# Altium schematic sheet Connectors.SchDoc
size A4; SheetNumber: 2; SheetTotal: 6
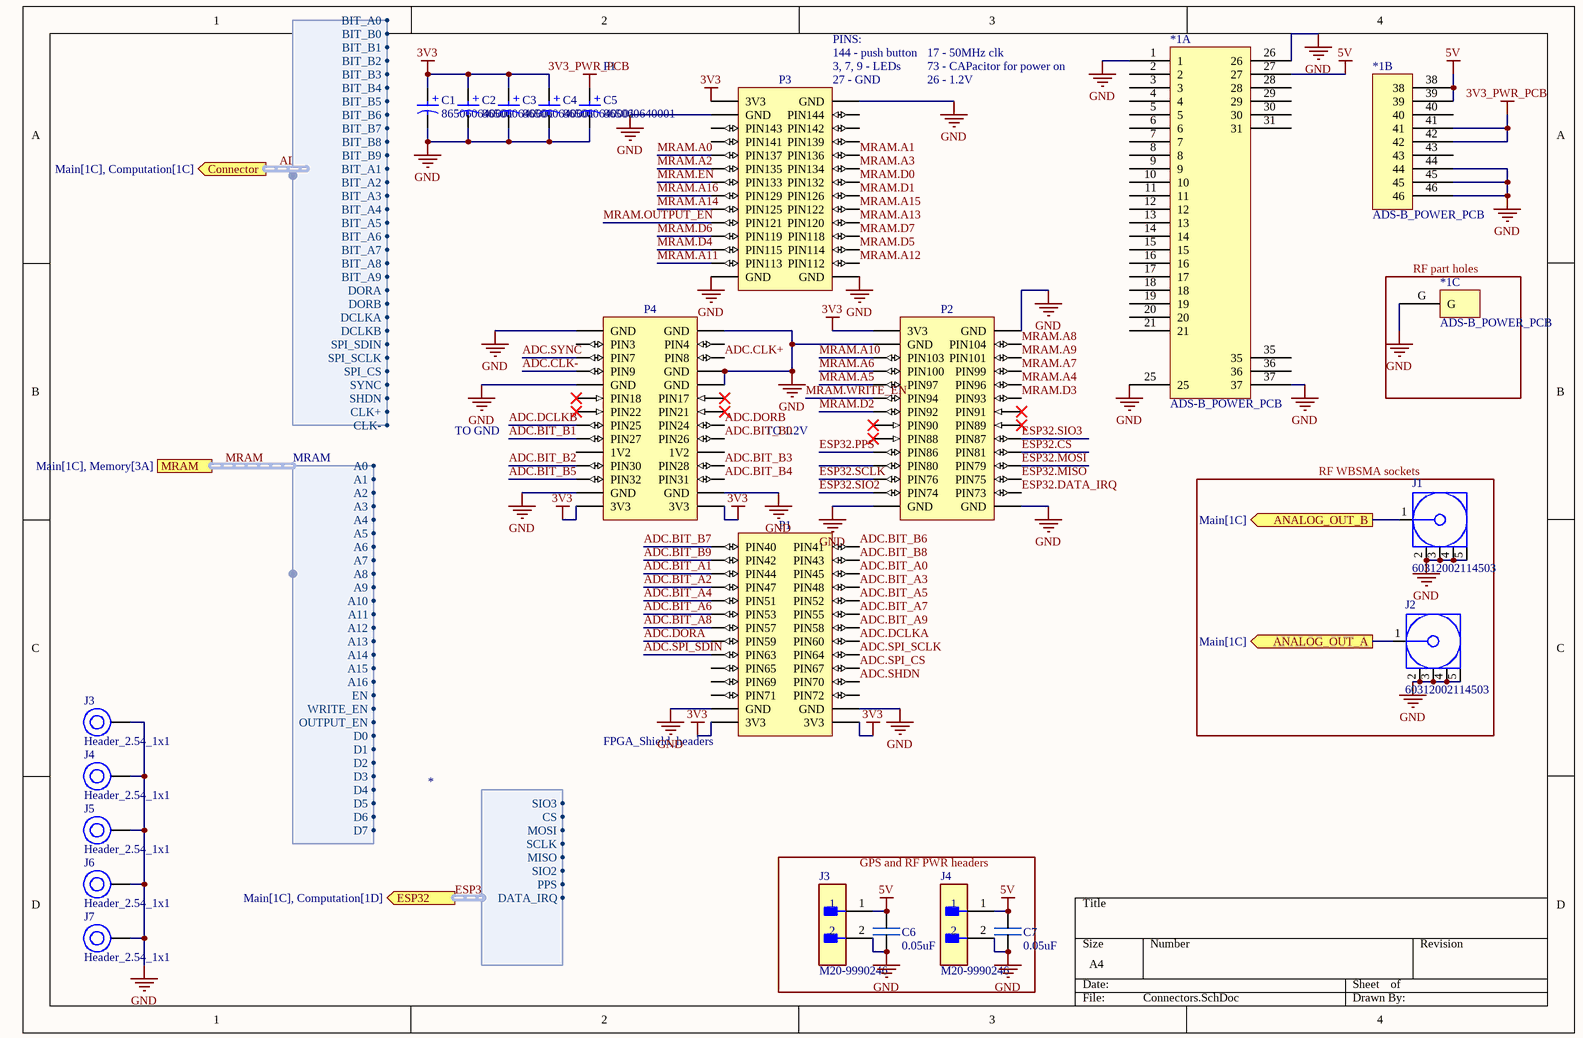
[diagram p0: Connectors.SchDoc]

## Parts
(Parts that share a designator on the sheet are numbered #1, #2 ... from top to bottom, then left to right.)
*1  ADS-B_POWER_PCB  [ADS-B_POWER_PCB]  (parts A,B,C of 3)
C1  865060640001  [WCAP-ASLL_D4H5.5]
C2  865060640001  [WCAP-ASLL_D4H5.5]
C3  865060640001  [WCAP-ASLL_D4H5.5]
C4  865060640001  [WCAP-ASLL_D4H5.5]
C5  865060640001  [WCAP-ASLL_D4H5.5]
C6  0.05uF  [0402_footprint]
C7  0.05uF  [0402_footprint]
J1  60312002114503  [60312002114503]
J2  60312002114503  [60312002114503]
J3#1  Header_2.54_1x1  [HEADER_2.54_1x1]
J3#2  M20-9990246  [FP-M20-9990246-MFG]
J4#1  Header_2.54_1x1  [HEADER_2.54_1x1]
J4#2  M20-9990246  [FP-M20-9990246-MFG]
J5  Header_2.54_1x1  [HEADER_2.54_1x1]
J6  Header_2.54_1x1  [HEADER_2.54_1x1]
J7  Header_2.54_1x1  [HEADER_2.54_1x1]
P1  FPGA_Shield_headers  [FPGA_SHIELD_HEADER_FOOTPRINT]

## Blocks framed on the sheet
RF part holes: *1
RF WBSMA sockets: J1 J2
GPS and RF PWR headers: C6 C7 J3#2 J4#2

## Ports
ANALOG_OUT_A (out, see Main[1C]), ANALOG_OUT_B (out, see Main[1C]), Connector (out, harness Connector, see Main[1C], Computation[1C]), ESP32 (out, harness *, see Main[1C], Computation[1D]), MRAM (harness MRAM, see Main[1C], Memory[3A])

## Harnesses
Connector: BIT_B1, BIT_B2, BIT_B3, BIT_B4, BIT_B5, BIT_B6, BIT_B7, BIT_B8, BIT_B9, BIT_A1, BIT_A2, BIT_A3, BIT_A4, BIT_A5, BIT_A6, BIT_A7, BIT_A8, BIT_A9, DORA, DORB, DCLKA, DCLKB, SPI_SDIN, SPI_SCLK, SPI_CS, SYNC, SHDN, BIT_B0, BIT_A0, CLK+, CLK-
MRAM: A0, A1, A2, A3, A4, A5, A6, A7, A8, A9, A10, A11, A12, A13, A14, A15, A16, EN, WRITE_EN, OUTPUT_EN, D0, D1, D2, D3, D4, D5, D6, D7
*: SIO3, CS, MOSI, SCLK, MISO, SIO2, PPS, DATA_IRQ

## Nets
3V3: C1.1(P) C2.1(P) C3.1(P) C4.1(P) P1.27(3V3) P1.28(3V3) P1.29(3V3) P1.57(3V3) P1.111(3V3) P1.112(3V3)
3V3_PWR_PCB: *1.41 *1.42 C5.1(P)
5V: *1.27 *1.38 *1.39 C6.2 C7.2 J3#2.1 J4#2.1
GND: *1.1 *1.25 *1.26 *1.37 *1.44 *1.45 *1.46 *1.G C1.2(N) C2.2(N) C3.2(N) C4.2(N) C5.2(N) C6.1 C7.1 J1.2(GND) J1.3(GND) J1.4(GND) J1.5(GND) J2.2(GND) J2.3(GND) J2.4(GND) J2.5(GND) J3#1.0 J3#2.2 J4#1.0 J4#2.2 J5.0 J6.0 J7.0 P1.1(GND) P1.2(GND) P1.8(GND) P1.9(GND) P1.10(GND) P1.25(GND) P1.26(GND) P1.30(GND) P1.31(GND) P1.55(GND) P1.56(GND) P1.58(GND) P1.59(GND) P1.83(GND) P1.84(GND) P1.109(GND) P1.110(GND)
ADC.BIT_A0: P1.90(PIN45)
ADC.BIT_A1: P1.89(PIN44)
ADC.BIT_A2: P1.91(PIN47)
ADC.BIT_A3: P1.92(PIN48)
ADC.BIT_A4: P1.93(PIN51)
ADC.BIT_A5: P1.94(PIN52)
ADC.BIT_A6: P1.95(PIN53)
ADC.BIT_A7: P1.96(PIN55)
ADC.BIT_A8: P1.97(PIN57)
ADC.BIT_A9: P1.98(PIN58)
ADC.BIT_B0: P1.18(PIN26)
ADC.BIT_B1: P1.17(PIN27)
ADC.BIT_B2: P1.21(PIN30)
ADC.BIT_B3: P1.22(PIN28)
ADC.BIT_B4: P1.24(PIN31)
ADC.BIT_B5: P1.23(PIN32)
ADC.BIT_B6: P1.86(PIN41)
ADC.BIT_B7: P1.85(PIN40)
ADC.BIT_B8: P1.88(PIN43)
ADC.BIT_B9: P1.87(PIN42)
ADC.CLK+: P1.6(PIN8)
ADC.CLK-: P1.7(PIN9)
ADC.DCLKA: P1.100(PIN60)
ADC.DCLKB: P1.15(PIN25)
ADC.DORA: P1.99(PIN59)
ADC.DORB: P1.16(PIN24)
ADC.SHDN: P1.106(PIN70)
ADC.SPI_CS: P1.104(PIN67)
ADC.SPI_SCLK: P1.102(PIN64)
ADC.SPI_SDIN: P1.101(PIN63)
ADC.SYNC: P1.5(PIN7)
ANALOG_OUT_A: J2.1(Signal) ; port ANALOG_OUT_A
ANALOG_OUT_B: J1.1(Signal) ; port ANALOG_OUT_B
ESP32.CS: P1.76(PIN81)
ESP32.DATA_IRQ: P1.82(PIN73)
ESP32.MISO: P1.80(PIN75)
ESP32.MOSI: P1.78(PIN79)
ESP32.PPS: P1.75(PIN86)
ESP32.SCLK: P1.79(PIN76)
ESP32.SIO2: P1.81(PIN74)
ESP32.SIO3: P1.74(PIN87)
MRAM.A0: P1.37(PIN137)
MRAM.A1: P1.38(PIN136)
MRAM.A2: P1.39(PIN135)
MRAM.A3: P1.40(PIN134)
MRAM.A4: P1.66(PIN96)
MRAM.A5: P1.65(PIN97)
MRAM.A6: P1.63(PIN100)
MRAM.A7: P1.64(PIN99)
MRAM.A8: P1.60(PIN104)
MRAM.A9: P1.62(PIN101)
MRAM.A10: P1.61(PIN103)
MRAM.A11: P1.53(PIN113)
MRAM.A12: P1.54(PIN112)
MRAM.A13: P1.48(PIN120)
MRAM.A14: P1.45(PIN125)
MRAM.A15: P1.46(PIN122)
MRAM.A16: P1.43(PIN129)
MRAM.D0: P1.42(PIN132)
MRAM.D1: P1.44(PIN126)
MRAM.D2: P1.69(PIN92)
MRAM.D3: P1.68(PIN93)
MRAM.D4: P1.51(PIN115)
MRAM.D5: P1.52(PIN114)
MRAM.D6: P1.49(PIN119)
MRAM.D7: P1.50(PIN118)
MRAM.EN: P1.41(PIN133)
MRAM.OUTPUT_EN: P1.47(PIN121)
MRAM.WRITE_EN: P1.67(PIN94)

Not connected (* = marked no-connect by the designer): *1 2 3 4 5 6 7 8 9 10 11 12 13 14 15 16 17 18 19 20 21 28 29 30 31 35 36 40 43; P1 3(PIN3) 4(PIN4) 11(PIN18)* 12(PIN17)* 13(PIN22)* 14(PIN21)* 19(1V2) 20(1V2) 32(PIN144) 33(PIN143) 34(PIN142) 35(PIN141) 36(PIN139) 70(PIN91)* 71(PIN90)* 72(PIN89)* 73(PIN88)* 77(PIN80) 103(PIN65) 105(PIN69) 107(PIN71) 108(PIN72)

## Buses and harness runs
harness ADC = port Connector
harness ESP32 = port ESP32
harness MRAM = port MRAM

## Notes on the sheet
- PINS:
- (near P1) 144 - push button
- (near P1) 3, 7, 9 - LEDs
- (near P1) 27 - GND
- (near P1) 17 - 50MHz clk
- (near P1) 73 - CAPacitor for power on
- (near P1) 26 - 1.2V
- TO GND
- (near P1) TO 1.2V
- (in symbol CMP-03913-53914524-1) +
- (in symbol FPGA_Shield_headers) P3; P4; P2

## Library data of the parts
C1-C5 = CMP-03913-53914524-1: 865060640001 WCAP-ASLL Aluminum Electrolytic Capacitors; Life (Hours): 2000hours; Polarity: Polar; Voltage Rating: 50V; Leakage Current: 3µA; Capacitance: 1µF; Ripple Current: 60mA; Tolerance: 20%; Insulation Resistance: 16.6667MΩ; Impedance: 4.4Ω; Min Operating Temperature: -55°C; NexarPartId: 53914524; Height - Seated (Max): 5.5118mm; Height: 5.5mm; Max Operating Temperature: 105°C; Length: 5.5mm; RoHS: Compliant; Voltage Rating (DC): 50V; Mount: Surface Mount; Ripple Current (AC): 60mA; Case/Package: Radial; Packaging: Tape & Reel (TR); Diameter: 4mm; REACH SVHC: Unknown
  C1: ComponentLink1Description: Buy; ComponentLink1URL: https://www.we-online.com/en/components/products/WCAP-ASLL#/articles/WCAP_ASLL_SIZE_4
C6 C7 = Capacitor_0402: 0402 capacitor
J1 J2 = CMP-207975-000002-2: SMA PCB THT JACK STRAIGHT WR-SMA; NexarPartId: 97004423; Insertion Loss (dB): 0.14dB; Number of Contacts: 1; Voltage Rating: 335V; Impedance: 50Ω; Frequency: 18GHz; Dielectric Material: PTFE; Insulation Resistance: 5GΩ; Orientation: Straight; Contact Material: Gold, Nickel; Min Operating Temperature: -65°C; Insulation Material: PTFE; Connector Type: SMA; Max Operating Temperature: 165°C; Height: 9.76mm
J3#1 J4#1 J5-J7 = Header_2.54_1x1: Header 1x1
J3#2 J4#2 = CMP-15831-000009-1: CONN HEADER VERT 2POS 2.54MM; Manufacturer: Harwin; Conn Gender: Male; Conn Orientation: Vertical; Number Of Contacts: 2; Current Rating: 3A; ComponentLink2URL: https://cdn.harwin.com/pdfs/M20-999.pdf; ComponentLink2Description: Datasheet; Package: M20-9990246; Temperature: -40°C to +105°C; Octopart: https://octopart.com/m20-9990246-harwin-2590635; Mouser Description: 2.54mm (0.1") Pitch SIL Vertical PC Tail Pin Header, 6.1mm mating pin height, tin, 2 contacts; Temperature Range High: +105°C; Device Class L1: Connectors; RoHS: TRUE; Automotive: No; Height: 8.99mm; Number Of Rows: 1; Contact Material: Tin,Nickel; Category: Conn; Pitch: 2.54mm; Lead Free: Yes; Digikey Description: CONN HEADER VERT 2POS 2.54MM; Manufacturer Part Number: M20-9990246; Temperature Range Low: -40°C; Device Class L3: unset; Device Class L2: Headers and Wire Housings